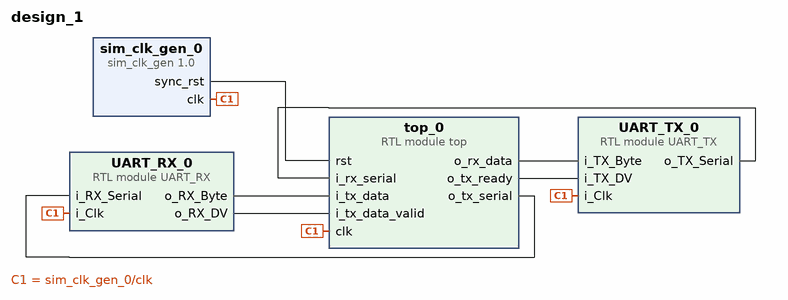
[diagram p0: block diagram of the top level]
# Vivado block design design_1, xc7a50ticsg324-1L, Vivado 2020.2
create_bd_design design_1

create_bd_cell -type module -reference top top_0
create_bd_cell -type module -reference UART_TX UART_TX_0
create_bd_cell -type module -reference UART_RX UART_RX_0
create_bd_cell -type ip -vlnv xilinx.com:ip:sim_clk_gen:1.0 sim_clk_gen_0

# ---- connections ----

connect_bd_net [get_bd_pins UART_TX_0/o_TX_Serial] [get_bd_pins top_0/i_rx_serial]
connect_bd_net [get_bd_pins top_0/o_tx_serial] [get_bd_pins UART_RX_0/i_RX_Serial]
connect_bd_net [get_bd_pins UART_RX_0/o_RX_Byte] [get_bd_pins top_0/i_tx_data]
connect_bd_net [get_bd_pins top_0/o_rx_data] [get_bd_pins UART_TX_0/i_TX_Byte]
connect_bd_net [get_bd_pins sim_clk_gen_0/clk] [get_bd_pins UART_RX_0/i_Clk] [get_bd_pins top_0/clk] [get_bd_pins UART_TX_0/i_Clk]
connect_bd_net [get_bd_pins top_0/o_tx_ready] [get_bd_pins UART_TX_0/i_TX_DV]
connect_bd_net [get_bd_pins UART_RX_0/o_RX_DV] [get_bd_pins top_0/i_tx_data_valid]
connect_bd_net [get_bd_pins sim_clk_gen_0/sync_rst] [get_bd_pins top_0/rst]

validate_bd_design
save_bd_design
